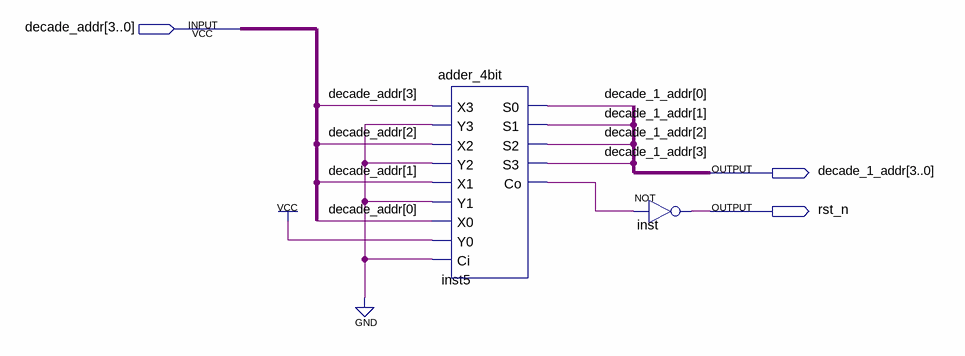
[diagram p0: schematic sheet]
// Quartus schematic addr_plus_one_4bit.bdf as structural Verilog: 2 symbols, 3 pins
module addr_plus_one_4bit (
  input  [3:0] decade_addr,
  output [3:0] decade_1_addr,
  output rst_n
);

  wire inst5_co;

  adder_4bit inst5 (
    .X3(decade_addr[3]), .Y3(1'b0), .X2(decade_addr[2]), .Y2(1'b0), .X1(decade_addr[1]), .Y1(1'b0),
    .X0(decade_addr[0]), .Y0(1'b1), .Ci(1'b0), .S0(decade_1_addr[0]), .S1(decade_1_addr[1]),
    .S2(decade_1_addr[2]), .S3(decade_1_addr[3]), .Co(inst5_co));
  not inst (rst_n, inst5_co);
endmodule
